# Altium project Hand Motor Driver Test Board.PrjPcb
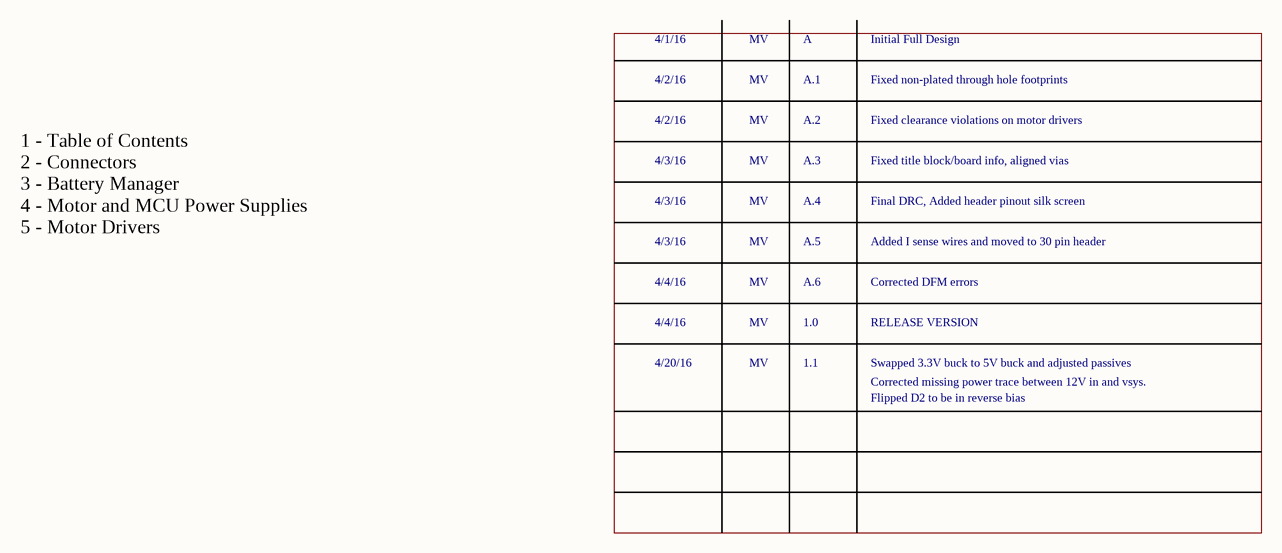
[diagram p0: TOC.SchDoc]
Title: Hand PSU Motor Test Board; Revision: 1.1
5 sheets, 115 parts. Net scope: global (net labels, ports and power ports of the same name join across sheets).
Board file: Motor_Board.PcbDoc
Sheets:
  TOC.SchDoc
  Connectors.SchDoc
  Battery Manager.SchDoc
  Power_Supply.SchDoc
  Motor_Drivers.SchDoc

## Sheet TOC.SchDoc: Table of Contents
size A4; CompanyName: St. Cloud State University; Organization: Senior Design Project; Address1: Prosthetic Hand; Address2: Matthew Varas; Address3: Rachel Mertz; Address4: Donnell Jones; DocumentNumber: 1; Revision: 1.1; SheetNumber: 1; SheetTotal: 5

### Notes on the sheet
- 4/1/16
- 4/2/16
- MV
- A
- A.1
- Initial Full Design
- Fixed non-plated through hole footprints
- 4/3/16
- A.2
- A.3
- Fixed clearance violations on motor drivers
- Fixed title block/board info, aligned vias
- A.4
- Final DRC, Added header pinout silk screen
- 1 - Table of Contents
  2 - Connectors
  3 - Battery Manager
  4 - Motor and MCU Power Supplies
  5 - Motor Drivers
- 4/4/16
- A.5
- A.6
- Added I sense wires and moved to 30 pin header
- Corrected DFM errors
- 4/20/16
- 1.0
- 1.1
- RELEASE VERSION
- Swapped 3.3V buck to 5V buck and adjusted passives
- Corrected missing power trace between 12V in and vsys.
- Flipped D2 to be in reverse bias
- Title
- Size:
- Date:
- A4
- Number:
- Time:
- Revision:
- Sheet
- of
- File:

## Sheet Connectors.SchDoc: Connectors
size A4; CompanyName: St. Cloud State University; Organization: Senior Design Project; Address1: Prosthetic Hand; Address2: Matthew Varas; Address3: Rachel Mertz; Address4: Donnell Jones; DocumentNumber: 2; Revision: 1.1; SheetNumber: 2; SheetTotal: 5
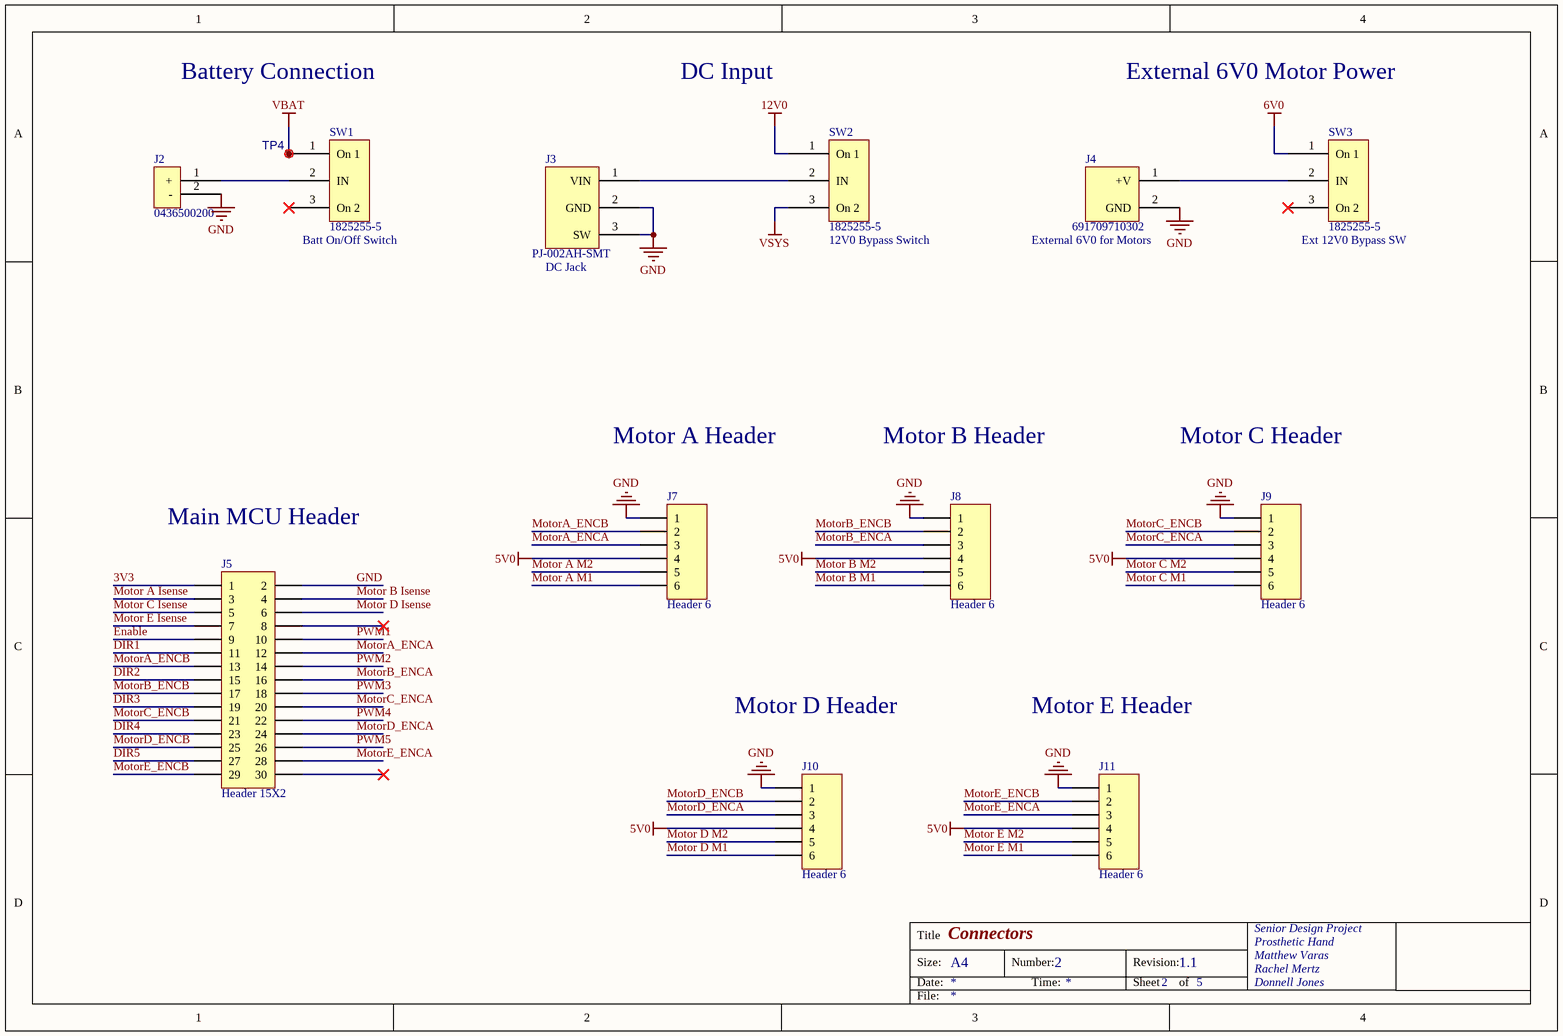
[diagram p1: Connectors.SchDoc]

### Parts
J2  0436500200  [43650-0200]
J3  PJ-002AH-SMT  [PJ-002AH-SMT]
J4  691709710302  [2-Pin Screw Terminal]
J5  Header 15X2  [HDR2X15]
J7  Header 6  [HDR1X6]
J8  Header 6  [HDR1X6]
J9  Header 6  [HDR1X6]
J10  Header 6  [HDR1X6]
J11  Header 6  [HDR1X6]
SW1  1825255-5  [On/Off/On Slider Switch]
SW2  1825255-5  [On/Off/On Slider Switch]
SW3  1825255-5  [On/Off/On Slider Switch]
TP4  Test Point  [Testpoint_70]  (value not drawn)

### Nets
5V0: J7.4 J8.4 J9.4 J10.4 J11.4
6V0: SW3.1(On_1)
12V0: SW2.1(On_1)
GND: J2.2(-) J3.2(GND) J3.3(SW) J4.2(GND) J5.2 J7.1 J8.1 J9.1 J10.1 J11.1
VBAT: SW1.1(On_1) TP4.1(M80)
VSYS: SW2.3(On_2)
3V3: J5.1
DIR1: J5.11
DIR2: J5.15
DIR3: J5.19
DIR4: J5.23
DIR5: J5.27
Enable: J5.9
Motor A Isense: J5.3
Motor A M1: J7.6
Motor A M2: J7.5
Motor B Isense: J5.4
Motor B M1: J8.6
Motor B M2: J8.5
Motor C Isense: J5.5
Motor C M1: J9.6
Motor C M2: J9.5
Motor D Isense: J5.6
Motor D M1: J10.6
Motor D M2: J10.5
Motor E Isense: J5.7
Motor E M1: J11.6
Motor E M2: J11.5
MotorA_ENCA: J5.12 J7.3
MotorA_ENCB: J5.13 J7.2
MotorB_ENCA: J5.16 J8.3
MotorB_ENCB: J5.17 J8.2
MotorC_ENCA: J5.20 J9.3
MotorC_ENCB: J5.21 J9.2
MotorD_ENCA: J5.24 J10.3
MotorD_ENCB: J5.25 J10.2
MotorE_ENCA: J5.28 J11.3
MotorE_ENCB: J5.29 J11.2
PWM1: J5.10
PWM2: J5.14
PWM3: J5.18
PWM4: J5.22
PWM5: J5.26
NetJ2_1: J2.1(+) SW1.2(IN)
NetJ3_1: J3.1(VIN) SW2.2(IN)
NetJ4_1: J4.1(+V) SW3.2(IN)

Not connected (* = marked no-connect by the designer): J5 8* 30*; SW1 3(On_2)*; SW3 3(On_2)*

### Notes on the sheet
- Battery Connection
- DC Input
- External 6V0 Motor Power
- Motor A Header
- Motor B Header
- Motor C Header
- Main MCU Header
- Motor D Header
- Motor E Header
- Title
- Size:
- Date:
- A4
- Number:
- Time:
- Revision:
- Sheet
- of
- File:
- (in symbol 1825255-5) Batt On/Off Switch; 12V0 Bypass Switch; Ext 12V0 Bypass SW
- (in symbol PJ-002AH-SMT) DC Jack
- (in symbol Screw Terminal 2-pin) External 6V0 for Motors

### Library data of the parts
J2 = Battery Connector: CONN HEADER 2POS 3MM RT ANG TIN; MFG_NAME01: Molex; DIGI_PN01: WM1860-ND; MFG_PN01: 43650-0200
J3 = PJ-002AH-SMT: CONN POWER JACK 2.1X5.5MM HI CUR; MFG_PN01: PJ-002AH-SMT-TR; DIGI_PN01: CP-002AHPJCT-ND; MFG_NAME01: CUI Inc.
J4 = Screw Terminal 2-pin: CONN TERM BLOCK 2POS 5MM BLACK; MFG_NAME01: Wurth Electronics Inc; DIGI_PN01: 1297-1108-1-ND; MFG_PN01: 691709710302
J5 = Header 15X2: 30 Position Receptacle Connector 0.100" (2.54mm) Through Hole Tin; MFG_PN01: SSW-115-01-T-D; DIGI_PN01: SAM1212-15-ND; MFG_NAME01: Samtec Inc; LatestRevisionDate: 17-Jul-2002; LatestRevisionNote: Re-released for DXP Platform.; Publisher: Altium Limited
J7-J11 = Header 6: CONN HEADER VERT 6POS .100 TIN; MFG_PN01: 3-644456-6; MFG_NAME01: TE Connectivity; DIGI_PN01: A31116-ND; LatestRevisionDate: 17-Jul-2002; LatestRevisionNote: Re-released for DXP Platform.; Publisher: Altium Limited
SW1-SW3 = 1825255-5: SWITCH SLIDE SPDT 300MA 125V; MFG_NAME01: TE Connectivity; DIGI_PN01: 450-1569-ND; MFG_PN01: 1825255-5
TP4 = Test Point: Test Pad; MFG_PN01: DNP; MFG_NAME01: DNP; DNP: DNP

## Sheet Battery Manager.SchDoc: Battery Manager
size A4; CompanyName: St. Cloud State University; Organization: Senior Design Project; Address1: Prosthetic Hand; Address2: Matthew Varas; Address3: Rachel Mertz; Address4: Donnell Jones; DocumentNumber: 3; Revision: 1.1; SheetNumber: 3; SheetTotal: 5
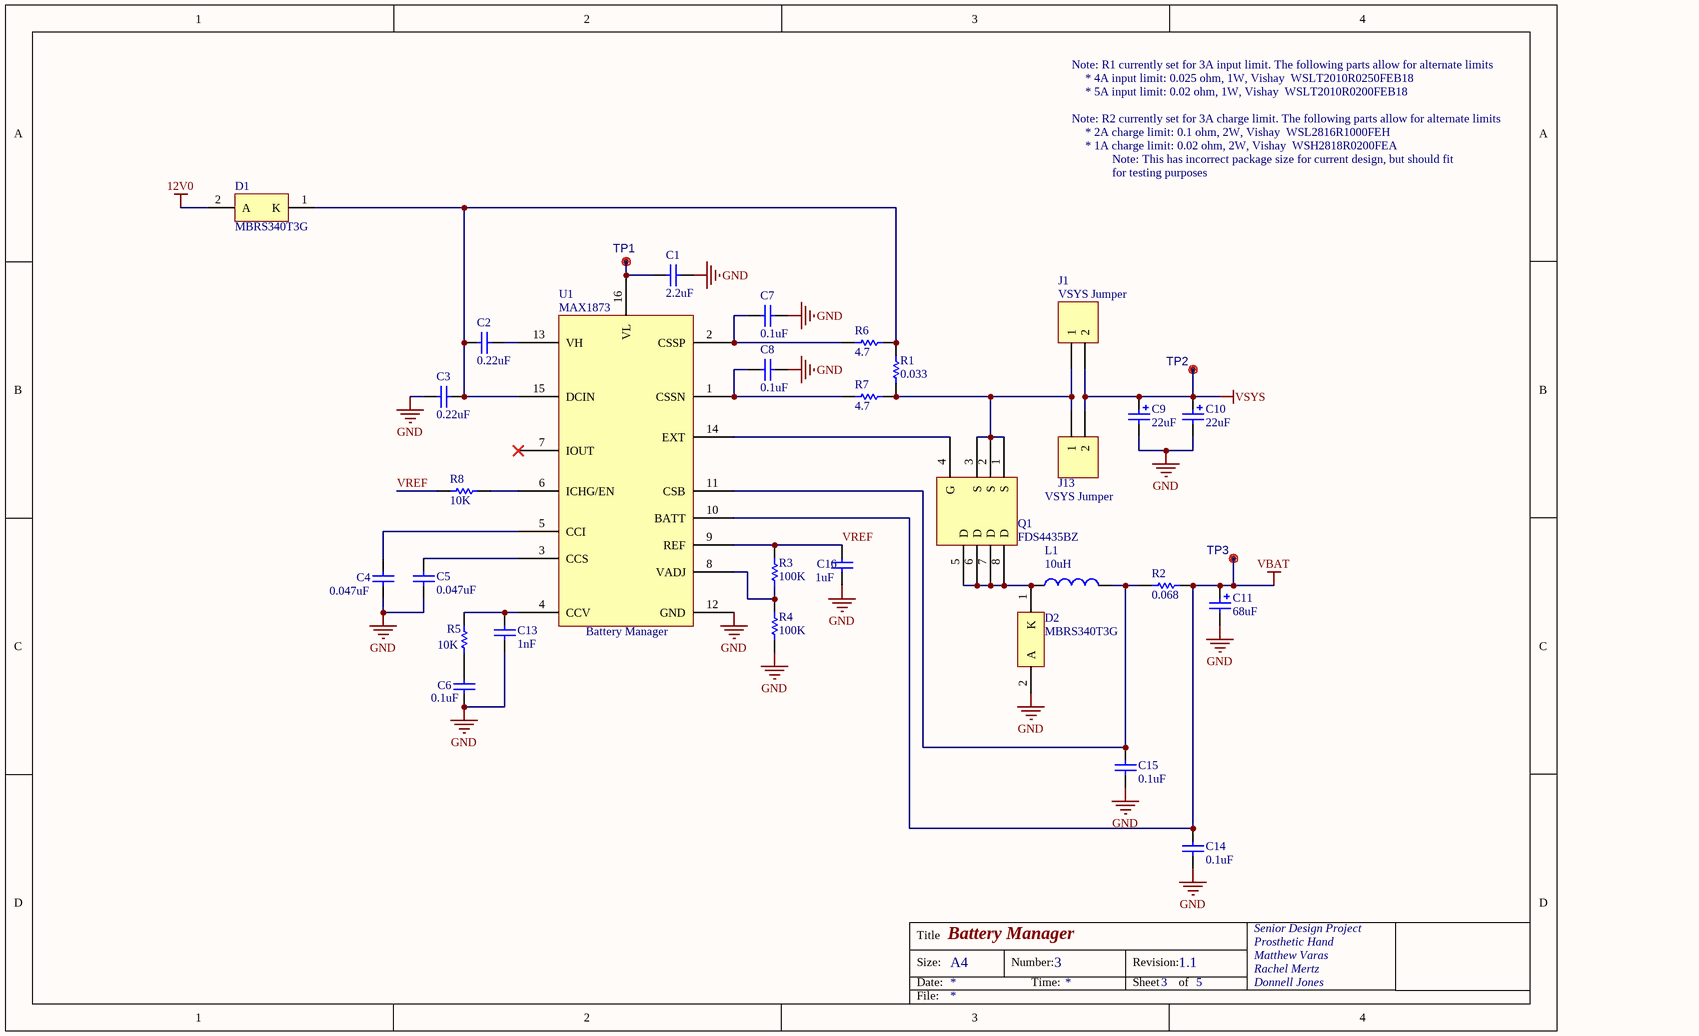
[diagram p2: Battery Manager.SchDoc]

### Parts
C1  2.2uF  [CAPC0805(2012)145_N]
C2  0.22uF  [CAPC0805(2012)145_N]
C3  0.22uF  [CAPC0805(2012)145_N]
C4  0.047uF  [CAPC0805(2012)75_N]
C5  0.047uF  [CAPC0805(2012)75_N]
C6  0.1uF  [CAPC0805(2012)145_N]
C7  0.1uF  [CAPC0805(2012)145_N]
C8  0.1uF  [CAPC0805(2012)145_N]
C9  22uF  [Cap Tant D]
C10  22uF  [Cap Tant D]
C11  68uF  [Cap Tant E]
C13  1nF  [CAPC0603(1608)100_N]
C14  0.1uF  [CAPC0805(2012)145_N]
C15  0.1uF  [CAPC0805(2012)145_N]
C16  1uF  [CAPC0805(2012)100_N]
D1  MBRS340T3G  [ONSC-SMC-2-403-03_V]
D2  MBRS340T3G  [ONSC-SMC-2-403-03_V]
J1  VSYS Jumper  [HDR1X2]
J13  VSYS Jumper  [HDR1X2]
L1  10uH  [SRR1260 Ind]
Q1  FDS4435BZ  [SOIC-8]
R1  0.033  [RESC2010(5025)_N]
R2  0.068  [WSL2816]
R3  100K  [RESC0805(2012)_N]
R4  100K  [RESC0805(2012)_N]
R5  10K  [RESC0805(2012)_N]
R6  4.7  [RESC0603(1608)_N]
R7  4.7  [RESC0603(1608)_N]
R8  10K  [RESC0805(2012)_N]
TP1  Test Point  [Testpoint_70]  (value not drawn)
TP2  Test Point  [Testpoint_70]  (value not drawn)
TP3  Test Point  [Testpoint_70]  (value not drawn)
U1  MAX1873  Desc: Battery Manager  [QSOP-16]

### Nets
12V0: D1.2(A)
GND: C1.2 C3.2 C4.2 C5.2 C6.1 C7.1 C8.1 C9.2 C10.2 C11.2 C13.1 C14.2 C15.1 C16.1 D2.2(A) R4.1 U1.12(GND)
VBAT: C11.1 C14.1 R2.1 TP3.1(M80) U1.10(BATT)
VSYS: C9.1 C10.1 J1.2 J13.2 TP2.1(M80)
VREF: C16.2 R3.2 R8.2 U1.9(REF)
NetC1_1: C1.1 TP1.1(M80) U1.16(VL)
NetC2_1: C2.1 C3.1 D1.1(K) R1.2 R6.1 U1.15(DCIN)
NetC2_2: C2.2 U1.13(VH)
NetC4_1: C4.1 U1.5(CCI)
NetC5_1: C5.1 U1.3(CCS)
NetC6_2: C6.2 R5.2
NetC7_2: C7.2 R6.2 U1.2(CSSP)
NetC8_2: C8.2 R7.2 U1.1(CSSN)
NetC13_2: C13.2 R5.1 U1.4(CCV)
NetC15_2: C15.2 L1.2 R2.2 U1.11(CSB)
NetD2_1: D2.1(K) L1.1 Q1.5(D) Q1.6(D) Q1.7(D) Q1.8(D)
NetJ1_1: J1.1 J13.1 Q1.1(S) Q1.2(S) Q1.3(S) R1.1 R7.1
NetQ1_4: Q1.4(G) U1.14(EXT)
NetR3_1: R3.1 R4.2 U1.8(VADJ)
NetR8_1: R8.1 U1.6(ICHG/EN)

Not connected (* = marked no-connect by the designer): U1 7(IOUT)*

### Notes on the sheet
- Note: R1 currently set for 3A input limit. The following parts allow for alternate limits
- * 4A input limit: 0.025 ohm, 1W, Vishay  WSLT2010R0250FEB18
- * 5A input limit: 0.02 ohm, 1W, Vishay  WSLT2010R0200FEB18
- Note: R2 currently set for 3A charge limit. The following parts allow for alternate limits
- * 2A charge limit: 0.1 ohm, 2W, Vishay  WSL2816R1000FEH
- * 1A charge limit: 0.02 ohm, 2W, Vishay  WSH2818R0200FEA
- Note: This has incorrect package size for current design, but should fit
- for testing purposes
- Title
- Size:
- Date:
- A4
- Number:
- Time:
- Revision:
- Sheet
- of
- File:

### Library data of the parts
C1 = CMP-1036-04844-1: CAP CER 2.2UF 50V X5R 0805; Tolerance: Â±10%; Case-EIA: 0805; Case-Metric: 2012; MFG_PN01: C2012X5R1H225K085AB; MFG_NAME01: TDK; DIGI_PN01: 445-14407-1-ND; Rated Voltage: 50 V; Max Thickness: 1.45 mm; Value: 2.2uF; Technology: SMT
C2 C3 = CMP-1036-04552-1: CAP CER 0.22UF 35V X5R 0805; Value: 220nF; Tolerance: Â±10%; Case-Metric: 2012; Case-EIA: 0805; Rated Voltage: 50 V; MFG_PN01: GMK212BJ224KG; MFG_NAME01: Taiyo Yuden; DIGI_PN01: 587-3366-1-ND; Max Thickness: 1.45 mm; Technology: SMT
C4 C5 = CMP-1036-04259-1: CAP CER 0.047UF 50V X7R 0805; Value: 47nF; Case-EIA: 0805; Case-Metric: 2012; Tolerance: Â±10%; MFG_PN01: GCM21BR71H473KA37L; MFG_NAME01: Murata; DIGI_PN01: 490-8050-1-ND; Max Thickness: 0.75 mm; Technology: SMT; Rated Voltage: 50 V
C6-C8 C14 C15 = CMP-1036-04419-1: CAP CER 0.1UF 50V X7R 0805; Tolerance: Â±10%; Case-EIA: 0805; Case-Metric: 2012; Value: 100nF; MFG_PN01: C2012X7R1H104K125AM; MFG_NAME01: TDK; DIGI_PN01: 445-6045-1-ND; Rated Voltage: 50 V; Technology: SMT; Max Thickness: 1.45 mm
C9 C10 = Cap Pol2: CAP TANT 22UF 35V 10% 2917; DIGI_PN01: 478-3356-1-ND; MFG_NAME01: AVX; MFG_PN01: TPSD226K035R0200; Case-EIA: 2917; Value: 22uF
C11 = Cap Pol2: CAP TANT 68UF 25V 20% 2917; DIGI_PN01: 478-4152-1-ND; MFG_NAME01: AVX; MFG_PN01: TPSE686M025R0125; Case-EIA: 2917; Value: 68uF
C13 = CMP-1035-01889-1: CAP CER 1000PF 50V X7R 0603; Tolerance: Â±10%; Case-EIA: 0603; Case-Metric: 1608; MFG_PN01: GRM188R71H102KA01D; MFG_NAME01: Murata; DIGI_PN01: 490-1494-1-ND; Value: 1nF; Technology: SMT; Rated Voltage: 50 V; Max Thickness: 1 mm
C16 = CMP-1036-04737-1: CAP CER 1UF 25V X7R 0805; Case-EIA: 0805; Rated Voltage: 10 V; Case-Metric: 2012; Tolerance: Â±10%; MFG_PN01: C2012X7R1E105K125AB; MFG_NAME01: TDK; DIGI_PN01: 445-1354-1-ND; Technology: SMT; Max Thickness: 1 mm; Value: 1uF
D1 D2 = CMP-1055-00380-1: DIODE SCHOTTKY 40V 4A SMC; Manufacturer: On Semiconductor; Configuration: Single; IFSM Max (A): 80; Packing: Tape and Reel; DIGI_PN01: MBRS340T3GOSCT-ND; Case-EIA: DO-214AB SMC; ComponentLink3Description: Package Specification; ComponentLink1Description: Manufacturer URL; DatasheetVersion: Rev. 11; PackageDescription: 2-Pin Small Molded Package, J-Bend Lead, Body 5.845 x 6.855 mm; PackageVersion: Rev. E, 08/2005; RoHS: TRUE; PackageReference: SMC-2-403-03; ComponentLink3URL: http://www.onsemi.com/pub_link/Collateral/403-03.PDF; ComponentLink2URL: http://www.onsemi.cn/pub_link/Collateral/MBRS340T3-D.PDF; PartNumber: MBRS340T3G; Mounting Technology: Surface Mount; ComponentLink1URL: http://www.onsemi.com/; ComponentLink2Description: Datasheet; MFG_PN01: MBRS340T3G; MFG_NAME01: ON Semiconductor
J1 J13 = Header 2: CONN HEADER .100 SINGL STR 2POS; MFG_PN01: PEC02SAAN; MFG_NAME01: Sullins Connector Solutions; DIGI_PN01: S1012E-02-ND; LatestRevisionDate: 17-Jul-2002; LatestRevisionNote: Re-released for DXP Platform.; Publisher: Altium Limited
L1 = SRR1260A-100MCT-ND: FIXED IND 10UH 5.5A 20 MOHM SMD; MFG_NAME01: Bourns; Current Rating: 5.5A; MFG_PN01: SRR1260A-100M; DIGI_PN01: SRR1260A-100MCT-ND; Value: 10uH
Q1 = FDS4435BZ: MOSFET P-CH 30V 8.8A 8-SOIC; MFG_NAME01: Fairchild Semiconductor; DIGI_PN01: FDS4435BZCT-ND; MFG_PN01: FDS4435BZ; Case-EIA: 8-SOIC
R1 = CMP-1017-00002-1: RES SMD 0.033 OHM 1% 1W 2010; Case-Metric: 5025; Case-EIA: 2010; MFG_PN01: WSL2010R0330FEA18; DIGI_PN01: WSLF-.033CT-ND; MFG_NAME01: Murata; Tolerance: 1%; Technology: SMT; Power: 1W; Value: 0.033
R2 = CMP-1017-00002-1: RES SMD 0.068 OHM 1% 2W 2816; Case-Metric: 5025; Case-EIA: 2816; MFG_PN01: WSL2816R0680FEH; DIGI_PN01: WSLK-.068CT-ND; MFG_NAME01: Vishay Dale; Tolerance: 1%; Technology: SMT; Power: 2W; Value: 0.068
R3 R4 = CMP-1013-00736-1: RES SMD 100K OHM 1% 1/8W 0805; Case-Metric: 2012; Power: 0.125 W; Case-EIA: 0805; MFG_PN01: RC0805FR-07100KL; DIGI_PN01: 311-100KCRCT-ND; MFG_NAME01: Yageo; Value: 100K; Tolerance: 1 %; Technology: SMT
R5 R8 = CMP-1013-00623-1: RES SMD 10K OHM 1% 1/8W 0805; Case-Metric: 2012; Case-EIA: 0805; Power: 0.125 W; MFG_PN01: RC0805FR-0710KL; MFG_NAME01: Yageo; DIGI_PN01: 311-10.0KCRCT-ND; Value: 10K; Tolerance: 1 %; Technology: SMT
R6 R7 = CMP-1012-00247-1: RES SMD 4.7 OHM 1% 1/10W 0603; Case-EIA: 0603; Power: 0.1 W; Case-Metric: 1608; Value: 4.70 Ohm; MFG_PN01: RC1608F4R7CS; MFG_NAME01: Samsung; DIGI_PN01: 1276-4486-1-ND; Technology: SMT; Tolerance: 1 %
TP1-TP3 = Test Point: Test Pad; MFG_PN01: DNP; MFG_NAME01: DNP; DNP: DNP
U1 = MAX1873: IC CNTRLR CHARGE LI+ 16-QSOP; MFG_PN01: MAX1873REEE+T; MFG_NAME01: Maxim Integrated; DIGI_PN01: MAX1873REEE+TCT-ND; Case-EIA: 16-SSOP

## Sheet Power_Supply.SchDoc: Power Supply
size A4; CompanyName: St. Cloud State University; Organization: Senior Design Project; Address1: Prosthetic Hand; Address2: Matthew Varas; Address3: Rachel Mertz; Address4: Donnell Jones; DocumentNumber: 4; Revision: 1.1; SheetNumber: 4; SheetTotal: 5
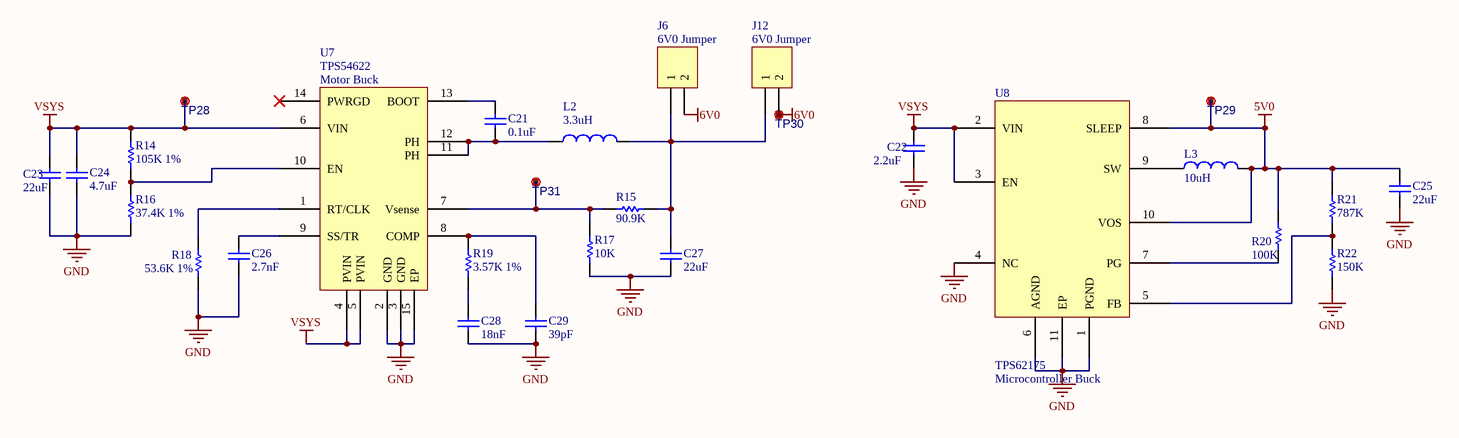
[diagram p3: Power_Supply.SchDoc]

### Parts
C21  0.1uF  [CAPC0805(2012)145_N]
C22  2.2uF  [CAPC0603(1608)100_N]
C23  22uF  [CAPC1206(3216)190_N]
C24  4.7uF  [CAPC0805(2012)145_N]
C25  22uF  [CAPC0805(2012)145_N]
C26  2.7nF  [CAPC0805(2012)145_N]
C27  22uF  [CAPC1206(3216)190_N]
C28  18nF  [CAPC0805(2012)145_N]
C29  39pF  [CAPC0805(2012)100_N]
J6  6V0 Jumper  [HDR1X2]
J12  6V0 Jumper  [HDR1X2]
L2  3.3uH  [INDM7265X40N]
L3  10uH  [SDR0503]
R14  105K 1%  [RESC0402(1005)_N]
R15  90.9K  [RESC0402(1005)_N]
R16  37.4K 1%  [RESC0402(1005)_N]
R17  10K  [RESC0402(1005)_N]
R18  53.6K 1%  [RESC0402(1005)_N]
R19  3.57K 1%  [RESC0402(1005)_N]
R20  100K  [RESC0402(1005)_N]
R21  787K  [RESC0603(1608)_N]
R22  150K  [RESC0603(1608)_N]
TP28  Test Point  [Testpoint_70]  (value not drawn)
TP29  Test Point  [Testpoint_70]  (value not drawn)
TP30  Test Point  [Testpoint_70]  (value not drawn)
TP31  Test Point  [Testpoint_70]  (value not drawn)
U7  TPS54622  Desc: Motor Buck  [S-PVQFN-N14]
U8  TPS62175  Desc: Microcontroller Buck  [R-PWSON-N10]

### Nets
5V0: C25.2 L3.2 R20.2 R21.1 TP29.1(M80) U8.8(SLEEP) U8.10(VOS)
6V0: J6.2 J12.2 TP30.1(M80)
GND: C22.1 C23.1 C24.1 C25.1 C26.1 C27.1 C28.1 C29.1 R16.1 R17.1 R18.1 R22.1 U7.2(GND) U7.3(GND) U7.15(EP) U8.1(PGND) U8.4(NC) U8.6(AGND) U8.11(EP)
VSYS: C22.2 C23.2 C24.2 R14.1 TP28.1(M80) U7.4(PVIN) U7.5(PVIN) U7.6(VIN) U8.2(VIN) U8.3(EN)
NetC21_1: C21.1 L2.1 U7.11(PH) U7.12(PH)
NetC21_2: C21.2 U7.13(BOOT)
NetC26_2: C26.2 U7.9(SS/TR)
NetC27_2: C27.2 J6.1 J12.1 L2.2 R15.2
NetC28_2: C28.2 R19.1
NetC29_2: C29.2 R19.2 U7.8(COMP)
NetL3_1: L3.1 U8.9(SW)
NetR14_2: R14.2 R16.2 U7.10(EN)
NetR15_1: R15.1 R17.2 TP31.1(M80) U7.7(Vsense)
NetR18_2: R18.2 U7.1(RT/CLK)
NetR20_1: R20.1 U8.7(PG)
NetR21_2: R21.2 R22.2 U8.5(FB)

Not connected (* = marked no-connect by the designer): U7 14(PWRGD)*

### Notes on the sheet
- Title
- Size:
- Date:
- A4
- Number:
- Time:
- Revision:
- Sheet
- of
- File:

### Library data of the parts
C21 = CMP-1036-04410-1: CAP CER 0.1UF 25V X7R 0805; Case-Metric: 2012; Case-EIA: 0805; Tolerance: Â±10%; MFG_PN01: 08053C104KAT2A; MFG_NAME01: AVX; DIGI_PN01: 478-3755-1-ND; Technology: SMT; Value: 0.1uF; Rated Voltage: 25 V; Max Thickness: 1.45 mm
C22 = CMP-1035-02763-1: CAP CER 2.2UF 16V X5R 0603; Case-Metric: 1608; Case-EIA: 0603; Tolerance: Â±10%; MFG_PN01: GRM188R61C225KE15D; MFG_NAME01: Murata; DIGI_PN01: 490-3296-2-ND; Value: 2.2uF; Max Thickness: 1 mm; Technology: SMT; Rated Voltage: 16 V
C23 = CMP-1037-04993-1: CAP CER 22UF 16V X5R 1206; Tolerance: Â±20%; Case-Metric: 3216; Case-EIA: 1206; MFG_PN01: GRM31CR61C226ME15L; DIGI_PN01: 490-4739-1-ND; MFG_NAME01: Murata; Value: 22uF; Rated Voltage: 16 V; Technology: SMT; Max Thickness: 1.9 mm
C24 = CMP-1036-04895-1: CAP CER 4.7UF 25V X5R 0805; Case-Metric: 2012; Case-EIA: 0805; Tolerance: Â±10%; MFG_PN01: GRM21BR61E475KA12L; MFG_NAME01: Murata; DIGI_PN01: 490-3335-1-ND; Value: 4.7uF; Technology: SMT; Rated Voltage: 25 V; Max Thickness: 1.45 mm
C25 = CMP-1036-04939-1: CAP CER 22UF 6.3V X5R 0805; Case-EIA: 0805; Tolerance: Â±20%; Case-Metric: 2012; MFG_PN01: GRM21BR60J226ME39L; MFG_NAME01: Murata; DIGI_PN01: 490-1719-1-ND; Max Thickness: 1.45 mm; Technology: SMT; Rated Voltage: 6.3 V; Value: 22uF
C26 = CMP-1036-03344-1: CAP CER 2700PF 50V X7R 0805; Tolerance: Â±10%; Case-Metric: 2012; Case-EIA: 0805; MFG_PN01: CC0805KRX7R9BB272; MFG_NAME01: Yageo; DIGI_PN01: 311-1130-1-ND; Value: 2.7nF; Max Thickness: 1.45 mm; Technology: SMT; Rated Voltage: 50 V
C27 = CMP-1037-04989-1: CAP CER 22UF 10V X5R 1206; Tolerance: Â±10%; Case-EIA: 1206; Case-Metric: 3216; MFG_PN01: GRM31CR61A226KE19L; MFG_NAME01: Murata; DIGI_PN01: 490-6510-1-ND; Max Thickness: 1.9 mm; Value: 22uF; Technology: SMT; Rated Voltage: 10 V
C28 = CMP-1036-04012-1: CAP CER 0.018UF 50V X7R 0805; Tolerance: Â±10%; Case-EIA: 0805; Case-Metric: 2012; MFG_PN01: CC0805KRX7R9BB183; MFG_NAME01: Yageo; DIGI_PN01: 311-1137-1-ND; Value: 18nF; Max Thickness: 1.45 mm; Rated Voltage: 50 V; Technology: SMT
C29 = CMP-1036-01521-1: CAP CER 39PF 50V NPO 0805; Case-Metric: 2012; Case-EIA: 0805; Tolerance: Â±5%; MFG_PN01: CC0805JRNPO9BN390; MFG_NAME01: Yageo; DIGI_PN01: 311-1106-1-ND; Technology: SMT; Rated Voltage: 50 V; Max Thickness: 1 mm; Value: 39pF
J6 J12 = Header 2: PEC02SAAN; MFG_NAME01: Sullins Connector Solutions; DIGI_PN01: S1012E-02-ND; LatestRevisionDate: 17-Jul-2002; LatestRevisionNote: Re-released for DXP Platform.; Publisher: Altium Limited; MFG_PN01: PEC02SAAN
L2 = Inductor: FIXED IND 3.3UH 6.5A 23 MOHM SMD; Code_IEC: 1005; MFG_PN01: SRP6540-3R3M; MFG_NAME01: Bourns; DIGI_PN01: SRP6540-3R3MCT-ND; Published: 8-Jun-2000; LatestRevisionDate: 29-May-2009; LatestRevisionNote: IPC-7351 Footprint Added.; PackageReference: Nonstandard; Publisher: Altium Limited; PackageDescription: Chip Inductor; Value: 3.3uH
L3 = Inductor: FIXED IND 10UH 1.3A 130 MOHM SMD; Code_IEC: 1005; Value: 10mH; MFG_PN01: SDR0503-100ML; MFG_NAME01: Bourns; DIGI_PN01: SDR0503-100MLCT-ND; Published: 8-Jun-2000; LatestRevisionDate: 29-May-2009; LatestRevisionNote: IPC-7351 Footprint Added.; PackageReference: 0402-A; Publisher: Altium Limited; PackageDescription: Chip Inductor; Code_JEITA: 0402
R14 = CMP-1011-00122-1: RES SMD 105K OHM 1% 1/16W 0402; Power: 0.063 W; Case-EIA: 0402; Case-Metric: 1005; MFG_PN01: CRCW0402105KFKED; MFG_NAME01: Vishay Dale; DIGI_PN01: 541-105KLCT-ND; Value: 105k; Technology: SMT; Tolerance: 1%
R15 = CMP-1011-00731-1: RES SMD 90.9K OHM 1% 1/16W 0402; Case-EIA: 0402; Power: 0.063 W; Case-Metric: 1005; MFG_PN01: CRCW040290K9FKED; MFG_NAME01: Vishay Dale; DIGI_PN01: 541-90.9KLCT-ND; Tolerance: 1 %; Technology: SMT; Value: 90.9K
R16 = CMP-1011-00111-1: RES SMD 37.4K OHM 1% 1/16W 0402; Case-EIA: 0402; Power: 0.063 W; Case-Metric: 1005; DIGI_PN01: 541-37.4KLCT-ND; MFG_PN01: CRCW040237K4FKED; MFG_NAME01: Vishay Dale; Value: 37.4K; Technology: SMT; Tolerance: 1%
R17 = CMP-1011-00623-1: RES SMD 10K OHM 1% 1/16W 0402; Case-Metric: 1005; Case-EIA: 0402; Power: 0.063 W; MFG_PN01: CRCW040210K0FKED; MFG_NAME01: Vishay Dale; DIGI_PN01: 541-10.0KLCT-ND; Value: 10K; Tolerance: 1 %; Technology: SMT
R18 = CMP-1011-00111-1: RES SMD 53.6K OHM 1% 1/16W 0402; Case-EIA: 0402; Power: 0.063 W; Case-Metric: 1005; MFG_PN01: CRCW040253K6FKED; MFG_NAME01: Vishay Dale; DIGI_PN01: 541-53.6KLCT-ND; Value: 53.6K; Technology: SMT; Tolerance: 1%
R19 = CMP-1011-00571-1: RES SMD 3.57K OHM 1% 1/16W 0402; Case-Metric: 1005; Case-EIA: 0402; Power: 0.063 W; MFG_PN01: CRCW04023K57FKED; MFG_NAME01: Vishay Dale; DIGI_PN01: 541-3.57KLCT-ND; Value: 3.57K; Technology: SMT; Tolerance: 1 %
R20 = CMP-1011-00122-1: RES SMD 100K OHM 1% 1/16W 0402; Power: 0.063 W; Case-EIA: 0402; Case-Metric: 1005; MFG_PN01: CRCW0402100KFKED; MFG_NAME01: Vishay Dale; DIGI_PN01: 541-100KLCT-ND; Value: 100k; Technology: SMT; Tolerance: 1 %
R21 = CMP-1012-00247-1: RES SMD 787K OHM 1% 1/10W 0603; Case-EIA: 0603; Power: 0.1 W; Case-Metric: 1608; MFG_PN01: RC0603FR-07787KL; MFG_NAME01: Yageo; DIGI_PN01: 311-787KHRCT-ND; Value: 787K Ohm; Technology: SMT; Tolerance: 1 %
R22 = CMP-1012-00247-1: RES SMD 150K OHM 1% 1/10W 0603; Case-EIA: 0603; Power: 0.1 W; Case-Metric: 1608; Tolerance: 0.1 %; MFG_PN01: RT0603BRD07150KL; MFG_NAME01: Yageo; DIGI_PN01: YAG1532CT-ND; Value: 150K Ohm; Technology: SMT
TP28-TP31 = Test Point: Test Pad; MFG_PN01: DNP; MFG_NAME01: DNP; DNP: DNP
U7 = TPS54622: IC REG BUCK ADJ 6A SYNC 14QFN; MFG_PN01: TPS54622RHLR; MFG_NAME01: Texas Instruments; DIGI_PN01: 296-29204-1-ND; Case-EIA: 14-VFQFN
U8 = TPS62175: IC REG BUCK BST 5V 0.8A 10WSON; MFG_NAME01: Texas Instruments; MFG_PN01: TPS62175DQCR; DIGI_PN01: 296-39451-1-ND; Case-EIA: 10-WFDFN

## Sheet Motor_Drivers.SchDoc: Motor Drivers
size A4; CompanyName: St. Cloud State University; Organization: Senior Design Project; Address1: Prosthetic Hand; Address2: Matthew Varas; Address3: Rachel Mertz; Address4: Donnell Jones; DocumentNumber: 5; Revision: 1.1; SheetNumber: 5; SheetTotal: 5
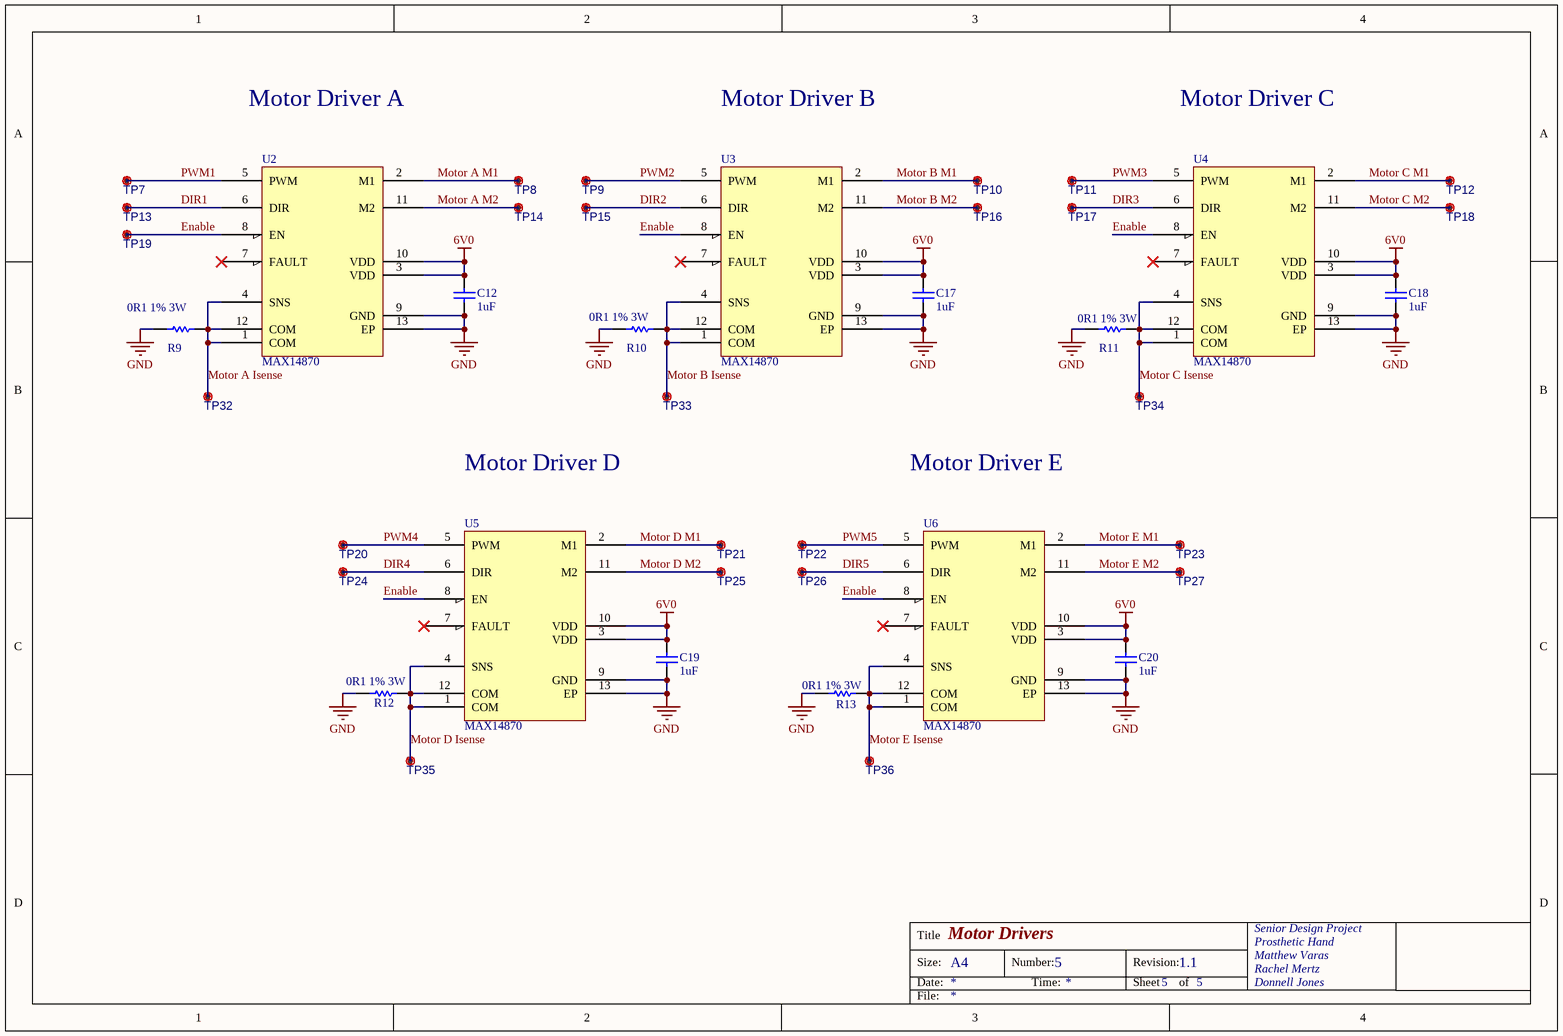
[diagram p4: Motor_Drivers.SchDoc]

### Parts
C12  1uF  [CAPC0402(1005)60_N]
C17  1uF  [CAPC0402(1005)60_N]
C18  1uF  [CAPC0402(1005)60_N]
C19  1uF  [CAPC0402(1005)60_N]
C20  1uF  [CAPC0402(1005)60_N]
R9  0R1 1% 3W  [RESC2512(6432)_N]
R10  0R1 1% 3W  [RESC2512(6432)_N]
R11  0R1 1% 3W  [RESC2512(6432)_N]
R12  0R1 1% 3W  [RESC2512(6432)_N]
R13  0R1 1% 3W  [RESC2512(6432)_N]
TP7  Test Point  [Testpoint_70]  (value not drawn)
TP8  Test Point  [Testpoint_70]  (value not drawn)
TP9  Test Point  [Testpoint_70]  (value not drawn)
TP10  Test Point  [Testpoint_70]  (value not drawn)
TP11  Test Point  [Testpoint_70]  (value not drawn)
TP12  Test Point  [Testpoint_70]  (value not drawn)
TP13  Test Point  [Testpoint_70]  (value not drawn)
TP14  Test Point  [Testpoint_70]  (value not drawn)
TP15  Test Point  [Testpoint_70]  (value not drawn)
TP16  Test Point  [Testpoint_70]  (value not drawn)
TP17  Test Point  [Testpoint_70]  (value not drawn)
TP18  Test Point  [Testpoint_70]  (value not drawn)
TP19  Test Point  [Testpoint_70]  (value not drawn)
TP20  Test Point  [Testpoint_70]  (value not drawn)
TP21  Test Point  [Testpoint_70]  (value not drawn)
TP22  Test Point  [Testpoint_70]  (value not drawn)
TP23  Test Point  [Testpoint_70]  (value not drawn)
TP24  Test Point  [Testpoint_70]  (value not drawn)
TP25  Test Point  [Testpoint_70]  (value not drawn)
TP26  Test Point  [Testpoint_70]  (value not drawn)
TP27  Test Point  [Testpoint_70]  (value not drawn)
TP32  Test Point  [Testpoint_70]  (value not drawn)
TP33  Test Point  [Testpoint_70]  (value not drawn)
TP34  Test Point  [Testpoint_70]  (value not drawn)
TP35  Test Point  [Testpoint_70]  (value not drawn)
TP36  Test Point  [Testpoint_70]  (value not drawn)
U2  MAX14870  [12L TDFN 3x3]
U3  MAX14870  [12L TDFN 3x3]
U4  MAX14870  [12L TDFN 3x3]
U5  MAX14870  [12L TDFN 3x3]
U6  MAX14870  [12L TDFN 3x3]

### Nets
6V0: C12.2 C17.2 C18.2 C19.2 C20.2 U2.3(VDD) U2.10(VDD) U3.3(VDD) U3.10(VDD) U4.3(VDD) U4.10(VDD) U5.3(VDD) U5.10(VDD) U6.3(VDD) U6.10(VDD)
GND: C12.1 C17.1 C18.1 C19.1 C20.1 R9.1 R10.1 R11.1 R12.1 R13.1 U2.9(GND) U2.13(EP) U3.9(GND) U3.13(EP) U4.9(GND) U4.13(EP) U5.9(GND) U5.13(EP) U6.9(GND) U6.13(EP)
DIR1: TP13.1(M80) U2.6(DIR)
DIR2: TP15.1(M80) U3.6(DIR)
DIR3: TP17.1(M80) U4.6(DIR)
DIR4: TP24.1(M80) U5.6(DIR)
DIR5: TP26.1(M80) U6.6(DIR)
Enable: TP19.1(M80) U2.8(EN) U3.8(EN) U4.8(EN) U5.8(EN) U6.8(EN)
Motor A Isense: R9.2 TP32.1(M80) U2.1(COM) U2.4(SNS) U2.12(COM)
Motor A M1: TP8.1(M80) U2.2(M1)
Motor A M2: TP14.1(M80) U2.11(M2)
Motor B Isense: R10.2 TP33.1(M80) U3.1(COM) U3.4(SNS) U3.12(COM)
Motor B M1: TP10.1(M80) U3.2(M1)
Motor B M2: TP16.1(M80) U3.11(M2)
Motor C Isense: R11.2 TP34.1(M80) U4.1(COM) U4.4(SNS) U4.12(COM)
Motor C M1: TP12.1(M80) U4.2(M1)
Motor C M2: TP18.1(M80) U4.11(M2)
Motor D Isense: R12.2 TP35.1(M80) U5.1(COM) U5.4(SNS) U5.12(COM)
Motor D M1: TP21.1(M80) U5.2(M1)
Motor D M2: TP25.1(M80) U5.11(M2)
Motor E Isense: R13.2 TP36.1(M80) U6.1(COM) U6.4(SNS) U6.12(COM)
Motor E M1: TP23.1(M80) U6.2(M1)
Motor E M2: TP27.1(M80) U6.11(M2)
PWM1: TP7.1(M80) U2.5(PWM)
PWM2: TP9.1(M80) U3.5(PWM)
PWM3: TP11.1(M80) U4.5(PWM)
PWM4: TP20.1(M80) U5.5(PWM)
PWM5: TP22.1(M80) U6.5(PWM)

Not connected (* = marked no-connect by the designer): U2 7(FAULT)*; U3 7(FAULT)*; U4 7(FAULT)*; U5 7(FAULT)*; U6 7(FAULT)*

### Notes on the sheet
- Motor Driver A
- Motor Driver B
- Motor Driver C
- Motor Driver D
- Motor Driver E
- Title
- Size:
- Date:
- A4
- Number:
- Time:
- Revision:
- Sheet
- of
- File:

### Library data of the parts
C12 C17-C20 = CMP-1034-02119-1: CAP CER 1UF 16V X5R 0402; Case-EIA: 0402; Tolerance: Â±10%; Case-Metric: 1005; MFG_PN01: GRT155R61C105KE01D; MFG_NAME01: Murata; DIGI_PN01: 490-12255-1-ND; Technology: SMT; Rated Voltage: 16 V; Max Thickness: 0.6 mm; Value: 1uF
R9-R13 = CMP-1018-00002-1: RES SMD 0.1 OHM 1% 3W 2512; Case-Metric: 6432; Value: 0.1 Ohm; Case-EIA: 2512; DIGI_PN01: CRA2512-FZ-R100ELFCT-ND; MFG_PN01: CRA2512-FZ-R100ELF; MFG_NAME01: Bourns; Technology: SMT; Power: 3W; Tolerance: 1%
TP7-TP27 TP32-TP36 = Test Point: Test Pad; MFG_PN01: DNP; MFG_NAME01: DNP; DNP: DNP
U2-U6 = MAX14870: IC MOTOR DVR DC FULL BR 12TDFN; MFG_NAME01: Maxim Integrated; MFG_PN01: MAX14870ETC+T; DIGI_PN01: MAX14870ETC+CT-ND; Case-EIA: 12-WFDFN

## Nets that join several sheets
5V0: Connectors (5 pins), Power_Supply (7 pins)
6V0: Connectors (SW3.1), Power_Supply (J6.2 J12.2 TP30.1), Motor_Drivers (15 pins)
12V0: Connectors (SW2.1), Battery Manager (D1.2)
GND: Connectors (10 pins), Battery Manager (17 pins), Power_Supply (19 pins), Motor_Drivers (20 pins)
VBAT: Connectors (SW1.1 TP4.1), Battery Manager (5 pins)
VSYS: Connectors (SW2.3), Battery Manager (5 pins), Power_Supply (10 pins)
DIR1: Connectors (J5.11), Motor_Drivers (TP13.1 U2.6)
DIR2: Connectors (J5.15), Motor_Drivers (TP15.1 U3.6)
DIR3: Connectors (J5.19), Motor_Drivers (TP17.1 U4.6)
DIR4: Connectors (J5.23), Motor_Drivers (TP24.1 U5.6)
DIR5: Connectors (J5.27), Motor_Drivers (TP26.1 U6.6)
Enable: Connectors (J5.9), Motor_Drivers (6 pins)
Motor A Isense: Connectors (J5.3), Motor_Drivers (5 pins)
Motor A M1: Connectors (J7.6), Motor_Drivers (TP8.1 U2.2)
Motor A M2: Connectors (J7.5), Motor_Drivers (TP14.1 U2.11)
Motor B Isense: Connectors (J5.4), Motor_Drivers (5 pins)
Motor B M1: Connectors (J8.6), Motor_Drivers (TP10.1 U3.2)
Motor B M2: Connectors (J8.5), Motor_Drivers (TP16.1 U3.11)
Motor C Isense: Connectors (J5.5), Motor_Drivers (5 pins)
Motor C M1: Connectors (J9.6), Motor_Drivers (TP12.1 U4.2)
Motor C M2: Connectors (J9.5), Motor_Drivers (TP18.1 U4.11)
Motor D Isense: Connectors (J5.6), Motor_Drivers (5 pins)
Motor D M1: Connectors (J10.6), Motor_Drivers (TP21.1 U5.2)
Motor D M2: Connectors (J10.5), Motor_Drivers (TP25.1 U5.11)
Motor E Isense: Connectors (J5.7), Motor_Drivers (5 pins)
Motor E M1: Connectors (J11.6), Motor_Drivers (TP23.1 U6.2)
Motor E M2: Connectors (J11.5), Motor_Drivers (TP27.1 U6.11)
PWM1: Connectors (J5.10), Motor_Drivers (TP7.1 U2.5)
PWM2: Connectors (J5.14), Motor_Drivers (TP9.1 U3.5)
PWM3: Connectors (J5.18), Motor_Drivers (TP11.1 U4.5)
PWM4: Connectors (J5.22), Motor_Drivers (TP20.1 U5.5)
PWM5: Connectors (J5.26), Motor_Drivers (TP22.1 U6.5)